# EAGLE design supply_LM1117 (EAGLE 6.1)
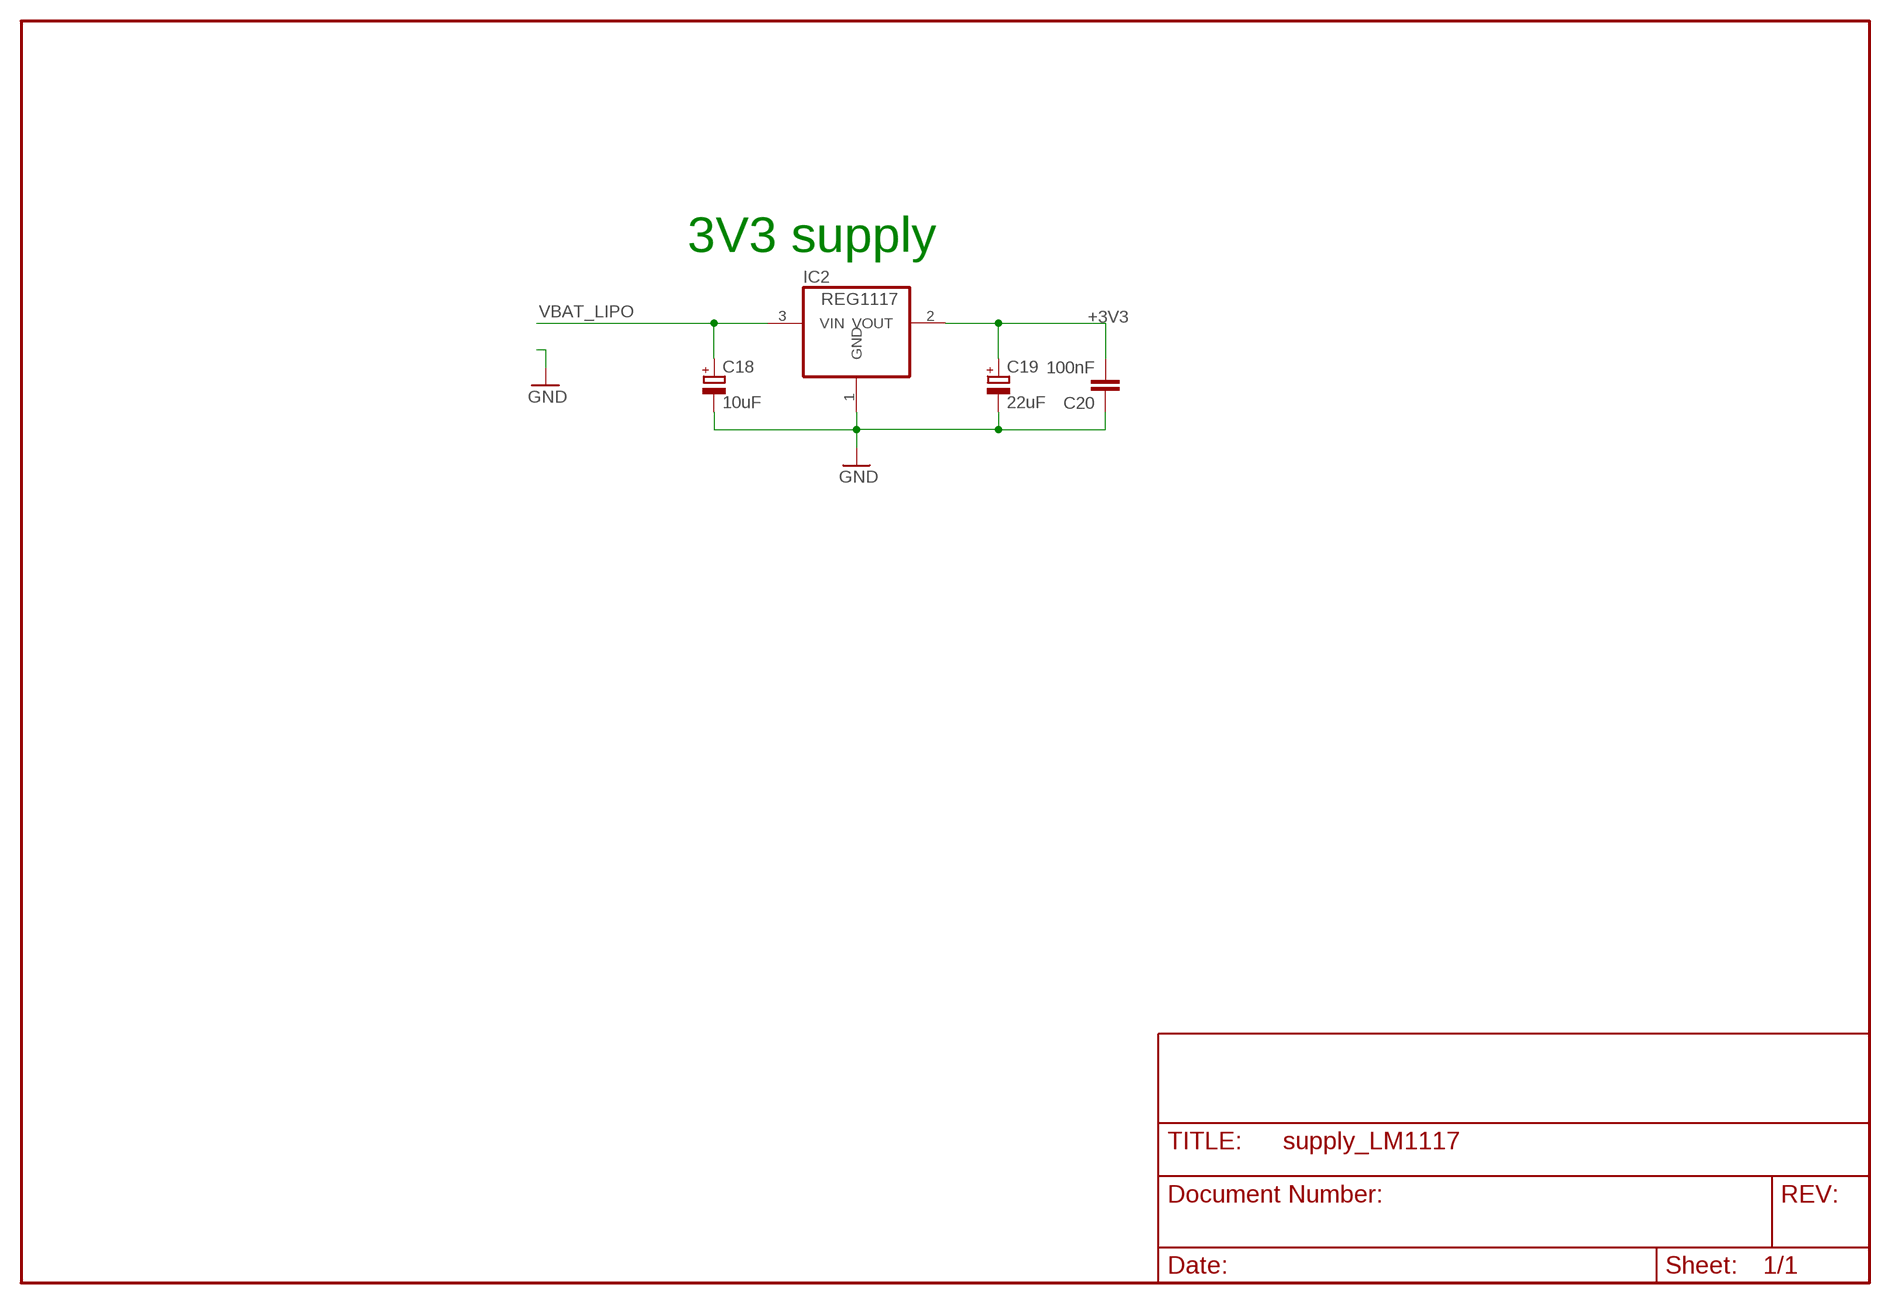
[diagram p0: schematic, sheet 1]

## Parts
C18  10uF  CPOL-EUB/3528-21R  [B/3528-21R]
C19  22uF  CPOL-EUB/3528-21R  [B/3528-21R]
C20  100nF  C-EUC0805K  [C0805K]
IC2  REG1117  [SOT223]

## Nets
+3V3: C19.+ C20.2 IC2.2(VOUT)
GND: C18.- C19.- C20.1 IC2.1(GND)
VBAT_LIPO: C18.+ IC2.3(VIN)

## Notes on the sheet
- 3V3 supply

## Library data of the parts
C18 C19 = rcl:CPOL-EU: POLARIZED CAPACITOR, European symbol
C20 = rcl:C-EU: CAPACITOR, European symbol
IC2 = burr-brown:REG1117: 800mA and 1A Low Dropout (LDO) Positive Regulator 1.8V, 2.5V, 2.85V, 3.3V, 5V, and Adj

## Board
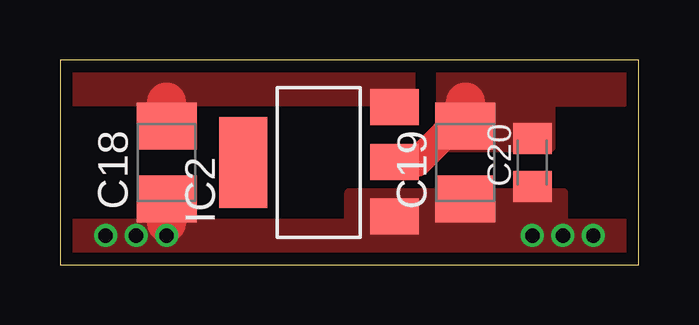
[diagram p1: board, top side]
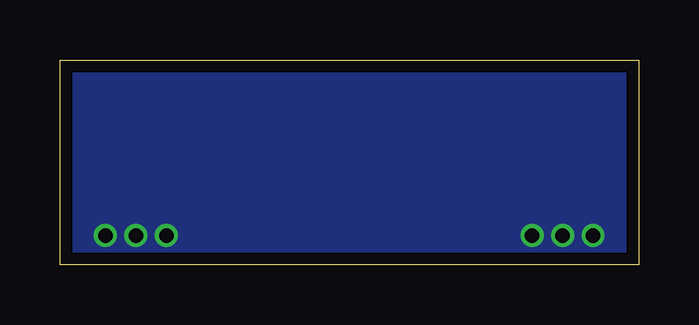
[diagram p2: board, bottom side, seen from below]

Size 24.11 x 8.56 mm. Coordinates in mm from the lower left corner, seen from the top.
Outline: 0,0 24.11,0 24.11,8.56 0,8.56 0,0
Copper layers (1*2+15*16): Top 0.035mm / dielectric 0.2mm / Route2 0.035mm / dielectric 1.5mm / Route15 0.035mm / dielectric 0.2mm / Bottom 0.035mm
Design rules: minimum track width 0.15mm, minimum drill 0.35mm, track to track 0.15mm, track to pad 0.15mm, pad to pad 0.15mm, via to via 0.15mm, smd to smd 0.15mm, copper to edge 20mil, drill to drill 8mil, minimum pad ring 0.177mm, minimum via ring 0.177mm, stop-mask expansion 4mil, vias tented up to drill 0mil, thermal gap 10mil

### Footprints (pad centres in the part's own frame; a part is rotated, then mirrored left to right if it is on the bottom)
B/3528-21R = smd 1.95 x 2.5: + 1.525,0; - -1.525,0
C0805K = smd 1.3 x 1.6: 1 -1,0; 2 1,0
SOT223 = smd 1.499 x 2.007: 1 -2.261,-3.15; 2 0.025,-3.15; 3 2.311,-3.15 | smd 3.81 x 2.007: 4 0,3.15

### Placement (x,y rotation side)
C18  4.44,4.28 90 top
C19  16.89,4.28 90 top
C20  19.68,4.28 90 top
IC2  10.79,4.28 90 top

### Tracks (layer width: path | path; a pad name or v marks a point on that pad's centre or on a via)
+3V3
  Top 1.219: 16.89,6.57 17.14,6.57 14.88,4.3 IC2.2
  Top 1.626: C19.+ 16.89,6.57 16.89,6.82
  pour Top (no thermals): 23.49,8.09 15.87,8.09 15.87,4.92 20.44,4.92 20.44,6.82 23.49,6.82
GND  (via drill 0.6)
  Top 1.626: C18.- 4.44,1.74
  other vias: 1.9,1.23 3.17,1.23 4.44,1.23 19.68,1.23 20.95,1.23 22.22,1.23
  pour Bottom: 0.63,8.09 23.49,8.09 23.49,0.47 0.63,0.47
  pour Top (no thermals): 0.63,1.74 12.06,1.74 12.06,3.01 20.95,3.01 20.95,1.74 23.49,1.74 23.49,0.47 0.63,0.47
VBAT_LIPO
  Top 1.626: C18.+ 4.44,6.82
  pour Top (no thermals): 0.63,8.09 14.6,8.09 14.6,6.82 0.63,6.82

### Text on the board
tDocu: VIN | VOUT | GND | GND